# Altium project Tempature Sensor.PrjPcb
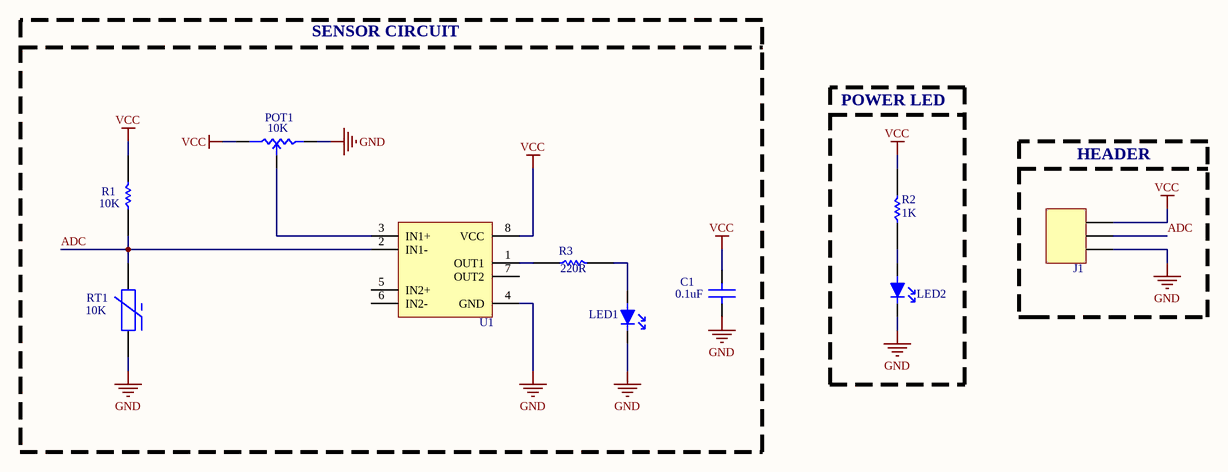
[diagram p0: Tempature Sensor.SchDoc]
1 sheet, 10 parts. Net scope: global (net labels, ports and power ports of the same name join across sheets).
Board file: Tempature Sensor.PcbDoc

## Sheet Tempature Sensor.SchDoc
size A3; SheetNumber: 1; SheetTotal: 1

### Parts
C1  value 0.1uF  [CAP_0805]  (hidden comment: CC0805KRX7R9BB104)
J1  61300311121  [HEADER]  (value not drawn)
LED1  150080RS75000  [LED_0805]  (value not drawn)
LED2  150080RS75000  [LED_0805]  (value not drawn)
POT1  value 10K  [TRIMMER]  (hidden comment: PV36W103C01B00)
R1  value 10K  [RES_0805]  (hidden comment: RC0805JR-0710KL)
R2  value 1K  [RES_0805]  (hidden comment: RC0805JR-071KL)
R3  value 220R  [RES_0805]  (hidden comment: RC0805JR-07220RL)
RT1  value 10K  [NTC]  (hidden comment: B57164K0103J000)
U1  LM358S-13  [SO-8]  (value not drawn)

### Blocks framed on the sheet
SENSOR CIRCUIT: C1 LED1 POT1 R1 R3 RT1 U1
POWER LED: LED2 R2
HEADER: J1

### Nets
GND: C1.1 J1.1 LED1.2 LED2.2 POT1.1 RT1.1 U1.4(GND)
VCC: C1.2 J1.3 POT1.3 R1.2 R2.2 U1.8(VCC)
ADC: J1.2 R1.1 RT1.2 U1.2(IN1-)
NetLED1_1: LED1.1 R3.2
NetLED2_1: LED2.1 R2.1
NetPOT1_2: POT1.2 U1.3(IN1+)
NetR3_1: R3.1 U1.1(OUT1)

Not connected (* = marked no-connect by the designer): U1 5(IN2+) 6(IN2-) 7(OUT2)

### Notes on the sheet
- Dosya Adı / File Name
- Hazırlayan / Prepared By
- Tanım / Description
- Değiştirme Tarihi / Changed Date
- Bölüm / Department
- Onaylayan / Approved By
- Kontrol Eden / Checked By
- Boyut / Size
- Sayfa / Sheet
- Revizyon / Revision

### Library data of the parts
C1 = CAP CER 0.1UF: CAP CER 0.1UF 50V X7R 0805
J1 = HEADER: CONN HEADER 3POS 2.54MM
LED1 LED2 = LED SMD: LED RED 0805 SMD
POT1 = POT 10K: TRIMMER 10K OHM 0.5W
R1 = RES 10K OHM: RES 10K OHM 5% 1/8W 0805
R2 = RES 1K OHM: RES 1K OHM 5% 1/8W 0805
R3 = RES 220 OHM: RES 220 OHM 5% 1/8W 0805
RT1 = NTC: THERMISTOR NTC 10KOHM 4300K
U1 = OPAMP: IC OPAMP GP 2 CIRCUIT 8SO